# EAGLE design main (EAGLE 6.1)
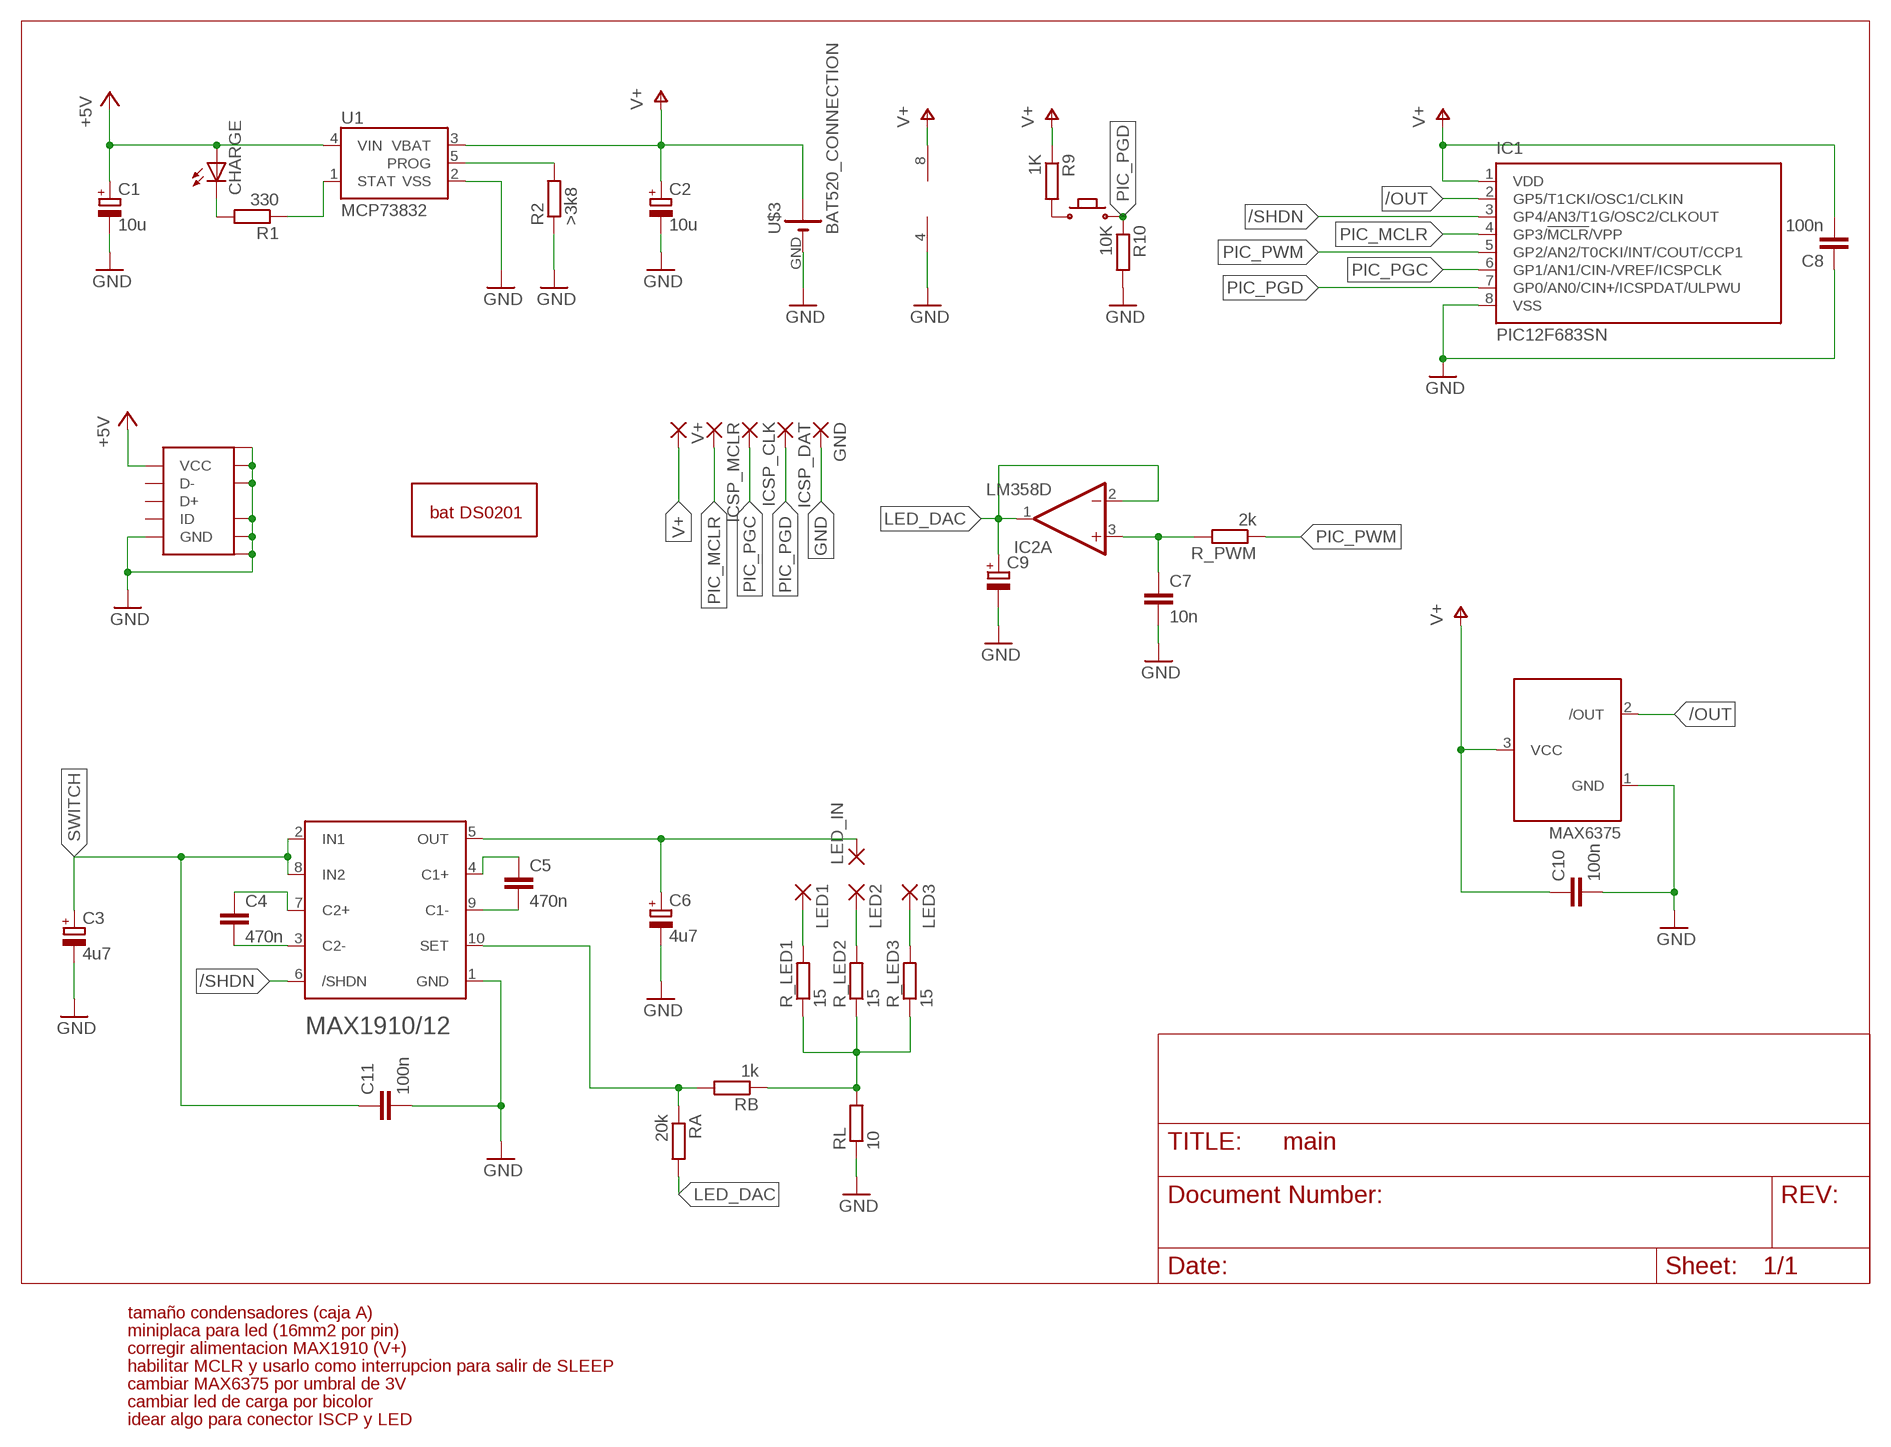
[diagram p0: schematic, sheet 1]

## Parts
C1  10u  CPOL-EUSMCA  [SMC_A]
C2  10u  CPOL-EUSMCA  [SMC_A]
C3  4u7  CPOL-EUSMCA  [SMC_A]
C4  470n  C-EUC1206  [C1206]
C5  470n  C-EUC1206  [C1206]
C6  4u7  CPOL-EUSMCA  [SMC_A]
C7  10n  C-EUC1206  [C1206]
C8  100n  C-EUC1206  [C1206]
C9  CPOL-EUSMCA  [SMC_A]
C10  100n  C-EUC1206  [C1206]
C11  100n  C-EUC1206  [C1206]
CHARGE  LEDCHIPLED_1206  [CHIPLED_1206]
GND  SMD5  [SMD2,54-5,08]
IC1  PIC12F683SN  [SO-08]
IC2  LM358D  [SO08]
ICSP_CLK  SMD5  [SMD2,54-5,08]
ICSP_DAT  SMD5  [SMD2,54-5,08]
ICSP_MCLR  SMD5  [SMD2,54-5,08]
LED1  SMD5  [SMD2,54-5,08]
LED2  SMD5  [SMD2,54-5,08]
LED3  SMD5  [SMD2,54-5,08]
LED_IN  SMD5  [SMD2,54-5,08]
R1  330  R-EU_R1206  [R1206]
R2  >3k8  R-EU_R1206  [R1206]
R9  1K  R-EU_R1206  [R1206]
R10  10K  R-EU_R1206  [R1206]
R_LED1  15  R-EU_R1206  [R1206]
R_LED2  15  R-EU_R1206  [R1206]
R_LED3  15  R-EU_R1206  [R1206]
R_PWM  2k  R-EU_R1206  [R1206]
RA  20k  R-EU_R1206  [R1206]
RB  1k  R-EU_R1206  [R1206]
RL  10  R-EU_R1206  [R1206]
U1  MCP73832  [SOT23-5]
U$1  MAX1910/12  [UMAX/USOP_10L]
U$2  MAX6375  [SC70-3-W]
U$3  BAT520_CONNECTION  [BAT520_CONN_SMD]
U$4  BAT_DS0201_PACKAGE  [BAT_DS0201]
U$5  MICRO_USB_B  [MICRO_USB_B]
U$6  MICROBUTTONE-MERCHAN  [MICROBUTTON_2]
V+  SMD5  [SMD2,54-5,08]

## Nets
+5V: C1.+ CHARGE.A U1.4(VIN) U$5.1(VCC)
/OUT: IC1.2(GP5/T1CKI/OSC1/CLKIN) U$2.2(/OUT)
/SHDN: IC1.3(GP4/AN3/T1G/OSC2/CLKOUT) U$1.6(/SHDN)
GND: C1.- C2.- C3.- C6.- C7.2 C8.1 C9.- C10.2 C11.2 GND.1(P) IC1.8(VSS) IC2.4(P:V-) R2.1 R10.2 RL.1 U1.2(VSS) U$1.1(GND) U$2.1(GND) U$3.GND(-) U$5.5(GND) U$5.GND1(GND) U$5.GND2(GND) U$5.GND3(GND) U$5.GND4(GND) U$5.GND5(GND) U$5.GND6(GND)
LED_DAC: C9.+ IC2.1(A:OUT) IC2.2(A:-IN) RA.2
N$1: R_LED1.1 R_LED2.1 R_LED3.1 RB.1 RL.2
N$2: C7.1 IC2.3(A:+IN) R_PWM.2
N$3: R2.2 U1.5(PROG)
N$4: R1.1 U1.1(STAT)
N$5: C4.2 U$1.3(C2-)
N$6: C4.1 U$1.7(C2+)
N$7: C5.2 U$1.9(C1-)
N$8: C5.1 U$1.4(C1+)
N$10: LED3.1(P) R_LED3.2
N$11: LED2.1(P) R_LED2.2
N$12: RA.1 RB.2 U$1.10(SET)
N$13: LED1.1(P) R_LED1.2
N$14: C6.+ LED_IN.1(P) U$1.5(OUT)
N$15: CHARGE.C R1.2
N$16: R9.2 U$6.P$1
PIC_MCLR: IC1.4(GP3/!MCLR!/VPP) ICSP_MCLR.1(P)
PIC_PGC: IC1.6(GP1/AN1/CIN-/VREF/ICSPCLK) ICSP_CLK.1(P)
PIC_PGD: IC1.7(GP0/AN0/CIN+/ICSPDAT/ULPWU) ICSP_DAT.1(P) R10.1 U$6.P$2
PIC_PWM: IC1.5(GP2/AN2/T0CKI/INT/COUT/CCP1) R_PWM.1
SWITCH: C3.+ C11.1 U$1.2(IN1) U$1.8(IN2)
V+: C2.+ C8.2 C10.1 IC1.1(VDD) IC2.8(P:V+) R9.1 U1.3(VBAT) U$2.3(VCC) U$3.VCC(+) V+.1(P)
Unconnected: IC2.5(B:+IN) IC2.6(B:-IN) IC2.7(B:OUT) U$5.2(D-) U$5.3(D+) U$5.4(ID)

## Notes on the sheet
- tamaño condensadores (caja A)
- miniplaca para led (16mm2 por pin)
- corregir alimentacion MAX1910 (V+)
- habilitar MCLR y usarlo como interrupcion para salir de SLEEP
- cambiar MAX6375 por umbral de 3V
- cambiar led de carga por bicolor
- idear algo para conector ISCP y LED

## Library data of the parts
C1-C3 C6 C9 = rcl:CPOL-EU: POLARIZED CAPACITOR, European symbol
C4 C5 C7 C8 C10 C11 = rcl:C-EU: CAPACITOR, European symbol
CHARGE = led:LED: LED OSRAM: - CHIPLED LG R971, LG N971, LY N971, LG Q971, LY Q971, LO R971, LY R971 LH N974, LH R974 LS Q976, LO Q976, LY Q976 LO Q996 - Hyper CHIPLED LW Q18S LB Q993, LB Q99A, LB R99A - SideLED LS A670, LO A670, LY A670, LG A670, LP A670 LB A673, LV A673, LT A673, LW A673 LH A674 LY A675 LS A676, LA A676, LO A676, LY A676, LW A676 LS A679, LY A679, LG A679 - Hyper Micro SIDELED® LS Y876, LA Y876, LO Y876, LY Y876 LT Y87S - SmartLED LW L88C, LW L88S LB L89C, LB L89S, LG L890 LS L89K, LO L89K, LY L89K LS L896, LA L896, LO L896, LY L896 - TOPLED LS T670, LO T670, LY T670, LG T670, LP T670 LSG T670, LSP T670, LSY T670, LOP T670, LYG T670 LG T671, LOG T671, LSG T671 LB T673, LV T673, LT T673, LW T673 LH T674 LS T676, LA T676, LO T676, LY T676, LB T676, LH T676, LSB T676, LW T676 LB T67C, LV T67C, LT T67C, LS T67K, LO T67K, LY T67K, LW E67C LS E67B, LA E67B, LO E67B, LY E67B, LB E67C, LV E67C, LT E67C LW T67C LS T679, LY T679, LG T679 LS T770, LO T770, LY T770, LG T770, LP T770 LB T773, LV T773, LT T773, LW T773 LH T774 LS E675, LA E675, LY E675, LS T675 LS T776, LA T776, LO T776, LY T776, LB T776 LHGB T686 LT T68C, LB T68C - Hyper Mini TOPLED® LB M676 - Mini TOPLED Santana® LG M470 LS M47K, LO M47K, LY M47K Source: http://www.osram.convergy.de LUXEON: - LUMILED® LXK2-PW12-R00, LXK2-PW12-S00, LXK2-PW14-U00, LXK2-PW14-V00 LXK2-PM12-R00, LXK2-PM12-S00, LXK2-PM14-U00 LXK2-PE12-Q00, LXK2-PE12-R00, LXK2-PE12-S00, LXK2-PE14-T00, LXK2-PE14-U00 LXK2-PB12-K00, LXK2-PB12-L00, LXK2-PB12-M00, LXK2-PB14-N00, LXK2-PB14-P00, LXK2-PB14-Q00 LXK2-PR12-L00, LXK2-PR12-M00, LXK2-PR14-Q00, LXK2-PR14-R00 LXK2-PD12-Q00, LXK2-PD12-R00, LXK2-PD12-S00 LXK2-PH12-R00, LXK2-PH12-S00 LXK2-PL12-P00, LXK2-PL12-Q00, LXK2-PL12-R00 Source: www.luxeon.com KINGBRIGHT: KA-3528ASYC Source: www.kingbright.com
GND ICSP_CLK ICSP_DAT ICSP_MCLR LED1-LED3 LED_IN V+ = wirepad:SMD5: SMD PAD
IC1 = microchip:PIC12F683: 8-Pin Flash-Based, 8-Bit CMOS Microcontrollers with nanoWatt Technology Source: http://ww1.microchip.com/downloads/en/DeviceDoc/41211D_.pdf; MF: MICROCHIP; MPN: PIC12F683-I/SN; OC_FARNELL: 9759042; OC_NEWARK: 61K3434
IC2 = linear:LM358: OP AMP also LM158; LM258; LM2904 Source: http://cache.national.com/ds/LM/LM158.pdf
R1 R2 R9 R10 R_LED1-R_LED3 R_PWM RA RB RL = rcl:R-EU_: RESISTOR, European symbol
U1 = dan:MCP73832: Microchip's MCP73832 Miniature single cell, fully integrated Li-Ion, Li-polymer charge management controller http://ww1.microchip.com/downloads/en/DeviceDoc/21984a.pdf
U$1 = dan:MAX1910/12: MAX1910/12 1.5X/2X High-Efficiency White LED Charge Pumps
U$2 = dan:MAX6375: MAX6375 3 pin, ultra-low-power sc70/sot23 voltage detectors
U$3 = dan:BAT520_CONNECTION
U$4 = dan:BAT_DS0201_PACKAGE
U$5 = dan:MICRO_USB_B: Receptáculo micro USB tipo B (móviles). REF tienda (www.rs-online.es): 669-4645. REF fabricante (TE Connectivity): 1981568-1.
U$6 = dan:MICROBUTTON

## Board
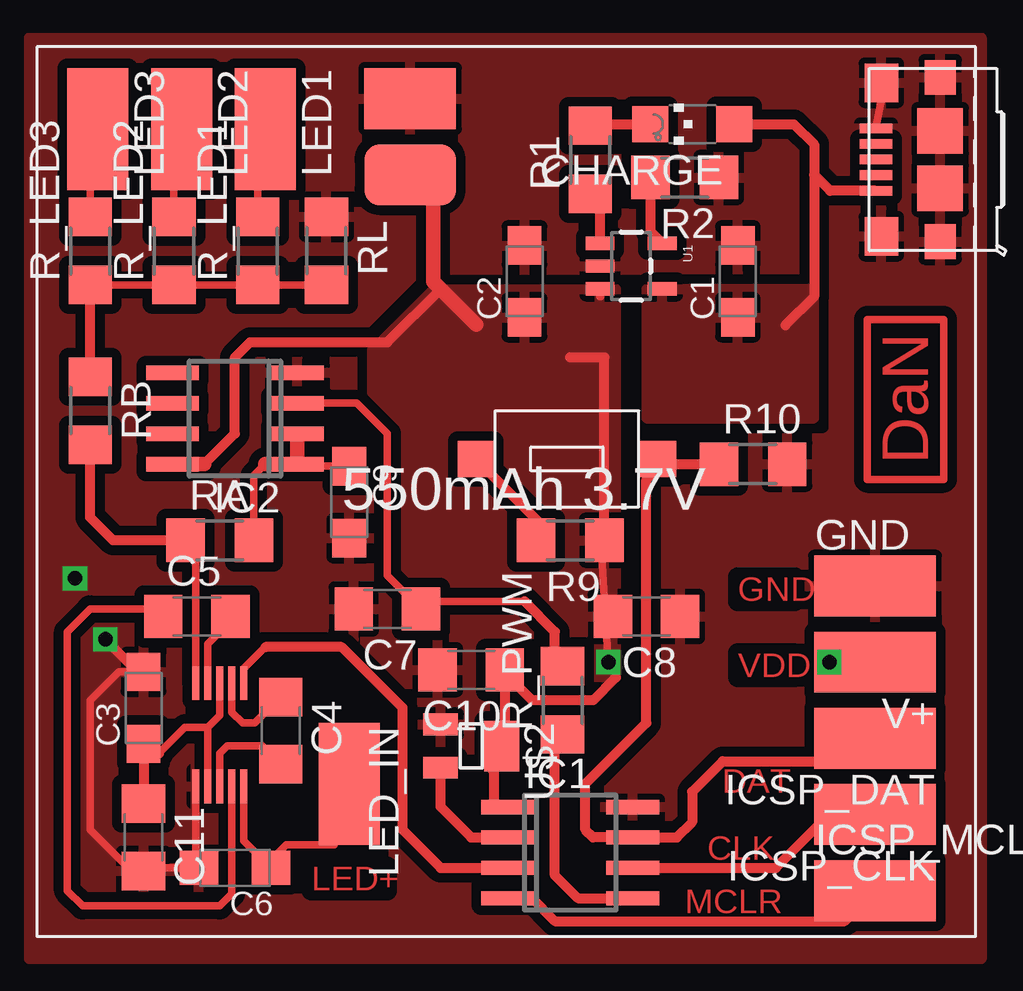
[diagram p1: board, top side]
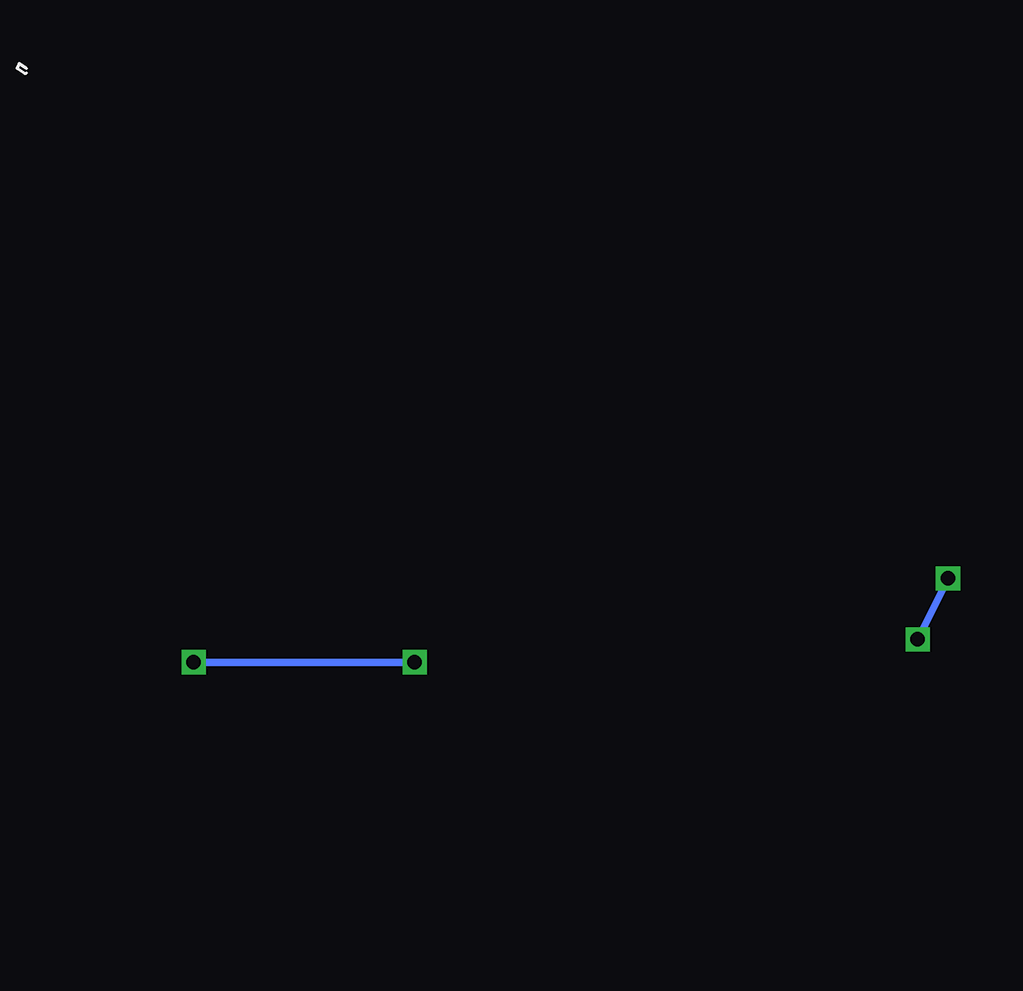
[diagram p2: board, bottom side, seen from below]

No outline drawn. Coordinates in mm, seen from the top.
Copper layers (1*16): Top 0.035mm / dielectric 1.5mm / Bottom 0.035mm
Design rules: minimum track width 10mil, minimum drill 24mil, track to track 16mil, track to pad 16mil, pad to pad 16mil, via to via 16mil, smd to smd 16mil, copper to edge 0mil, drill to drill 8mil, minimum pad ring 10mil, minimum via ring 8mil, stop-mask expansion 4mil, vias tented up to drill 0mil, thermal gap 10mil

### Footprints (pad centres in the part's own frame; a part is rotated, then mirrored left to right if it is on the bottom)
SMC_A = smd 1.6 x 1.4: + -1.5,0; - 1.5,0
C1206 = smd 1.6 x 1.8: 1 -1.4,0; 2 1.4,0
CHIPLED_1206 = smd 1.5 x 1.5: A 0,-1.75; C 0,1.75
SMD2,54-5,08 = smd 2.54 x 5.08: 1 0,0
SO-08 = smd 0.6 x 2.2: 1 -1.905,-2.6; 2 -0.635,-2.6; 3 0.635,-2.6; 4 1.905,-2.6; 5 1.905,2.6; 6 0.635,2.6; 7 -0.635,2.6; 8 -1.905,2.6
SO08 = smd 0.6 x 2.2: 1 -1.905,-2.6; 2 -0.635,-2.6; 3 0.635,-2.6; 4 1.905,-2.6; 5 1.905,2.6; 6 0.635,2.6; 7 -0.635,2.6; 8 -1.905,2.6
R1206 = smd 1.6 x 1.803: 1 -1.422,0; 2 1.422,0
SOT23-5 = smd 0.55 x 1.2: 1 -0.95,-1.3; 2 0,-1.3; 3 0.95,-1.3; 4 0.95,1.3; 5 -0.95,1.3
UMAX/USOP_10L = smd 1.4 x 0.28: 1 -2,1; 2 -2,0.5; 3 -2,0; 4 -2,-0.5; 5 -2,-1; 6 2.3,-1; 7 2.3,-0.5; 8 2.3,0; 9 2.3,0.5; 10 2.3,1
SC70-3-W = smd 0.9 x 1.45: 1 -0.9,-1.275; 2 0.9,-1.275 | smd 2.1 x 1.45: 3 0,1.275
BAT520_CONN_SMD = smd 2.54 x 3.81: GND 1.905,0; VCC -1.27,0
MICRO_USB_B = smd 0.4 x 1.35: 1 -1.3,1.865; 2 -0.65,1.865; 3 0,1.865; 4 0.65,1.865; 5 1.3,1.865 | smd 1.6 x 1.4: GND1 -3.2,1.64; GND2 3.2,1.64 | smd 1.45 x 1.3: GND3 -3.425,-0.81; GND4 3.425,-0.81 | smd 1.9 x 1.9: GND5 -1.2,-0.81; GND6 1.2,-0.81
MICROBUTTON_2 = smd 1.5 x 1.5: P$1 3.625,0.095; P$2 -3.975,0.095

### Placement (x,y rotation side)
C1  29.21,27.3 90 top
C2  20.32,27.3 90 top
C3  4.45,9.53 90 top
C4  10.16,8.57 270 top
C5  6.67,13.34 0 top
C6  8.26,2.86 180 top
C7  14.61,13.65 180 top
C8  25.4,13.34 180 top
C9  13.02,18.1 270 top
C10  18.1,11.11 180 top
C11  4.45,4.13 270 top
CHARGE  27.32,33.86 90 top
GND  34.92,14.61 270 top
IC1  22.23,3.49 270 top
IC2  8.26,21.59 90 top
ICSP_CLK  34.92,5.08 90 top
ICSP_DAT  34.92,8.26 90 top
ICSP_MCLR  34.92,1.91 270 top
LED1  9.53,33.66 180 top
LED2  6.03,33.66 180 top
LED3  2.54,33.66 180 top
LED_IN  13.02,6.35 180 top
R1  23.06,32.38 90 top
R2  27,31.64 180 top
R9  22.23,16.51 180 top
R10  29.84,19.68 0 top
R_LED1  9.21,28.57 90 top
R_LED2  5.71,28.57 90 top
R_LED3  2.22,28.57 90 top
R_PWM  21.91,9.84 90 top
RA  7.62,16.51 0 top
RB  2.22,21.91 270 top
RL  12.06,28.57 270 top
U1  24.77,27.94 270 top
U$1  7.62,8.26 90 top
U$2  18.1,7.94 270 top
U$3  15.56,33.02 90 top
U$4  19.05,19.05 0 top
U$5  36.83,32.38 90 top
U$6  21.91,20 180 top
V+  34.92,11.43 90 top

### Tracks (layer width: path | path; a pad name or v marks a point on that pad's centre or on a via)
+5V
  Top 0.406: CHARGE.A 31.55,33.86 32.38,33.02 32.38,31.75 | 32.38,31.75 32.38,26.67 31.19,25.48 | U$5.1 33.05,31.09 32.38,31.75
  pour Top (isolate 0.305): 25.4,26.99 25.4,21.59 32.38,21.59 32.38,26.99
/OUT
  Top 0.406: U$2.2 16.82,5.4 18.1,4.13 IC1.2
/SHDN
  Top 0.305: U$1.6 8.62,11.16 9.53,12.06
  Top 0.406: IC1.3 16.83,2.86 15.24,4.45 15.24,9.53 12.7,12.06 9.53,12.06
GND  (via drill 0.6)
  Top 0.305: U$5.5 35.28,35.36 U$5.GND2 | v1.59,14.92 1.27,15.24 | U$1.1 6.62,2.99 C6.- 4.58,2.86 C11.2 3.94,2.73 2.22,4.45 2.22,9.84 3.4,11.03 C3.-
  Top 0.406: v2.86,12.38 4.21,11.03 C3.-
  Bottom 0.305: v2.86,12.38 v1.59,14.92
  pour Top (rank 6): 39.37,-0.95 -0.32,-0.95 -0.32,37.47 39.37,37.47
LED_DAC
  Top 0.305: RA.2 9.04,19.2 9.53,19.68 | C9.+ 10.88,19.6 10.79,19.68
  Top 0.61: IC2.2 IC2.1 10.79,19.68 9.53,19.68
N$1
  Top 0.305: 2.54,26.67 R_LED3.1 R_LED2.1 R_LED1.1 RL.2
  Top 0.406: RB.1 R_LED3.1
N$2
  Top 0.305: 20.32,13.97 15.88,13.97 15.88,13.34 16,13.46 C7.1 14.61,15.05 14.61,20.95 13.34,22.23 IC2.3
  Top 0.406: R_PWM.2 21.59,11.58 21.59,12.7 20.32,13.97
N$3
  Top 0.406: U1.5 25.58,29.38 R2.2
N$4
  Top 0.406: R1.1 23.46,30.55 U1.1
N$5
  Top 0.305: U$1.3 7.62,7.62 7.94,7.94 9.39,7.94 C4.2
N$6
  Top 0.305: U$1.7 8.12,9.34 8.57,8.89 9.08,8.89 C4.1
N$7
  Top 0.305: U$1.9 7.12,12.2 8.26,13.34 C5.2
N$8
  Top 0.305: U$1.4 8.12,1.77 7.62,1.27 1.91,1.27 1.27,1.91 1.27,12.7 2.22,13.65 4.76,13.65 arc-90 5.08,13.34 C5.1
N$9
  Top 0.305: 37.78,19.05 37.78,25.72 34.61,25.72 34.61,19.05 37.78,19.05
N$10
  Top 0.305: R_LED3.2 2.22,33.34 LED3.1
N$11
  Top 0.305: R_LED2.2 5.71,33.34 LED2.1
N$12
  Top 0.305: U$1.10 6.62,16.51 RA.1
  Top 0.406: 6.35,16.51 RA.1 3.17,16.51 2.22,17.46 RB.2 2.22,20.64
N$13
  Top 0.305: R_LED1.2 9.21,33.34 LED1.1
N$14
  Top 0.254: LED_IN.1 13.34,6.35
  Top 0.305: U$1.5 8.62,3.99 C6.+ 9.53,2.63 | 13.34,6.35 12.38,5.4 12.38,3.81 10.39,3.81 9.53,2.94 | 9.53,2.94 9.53,2.63 | 9.53,2.94 9.53,3.17 | 9.53,2.63 9.53,2.54
N$15
  Top 0.406: R1.2 23.12,33.86 CHARGE.C
N$16
  Top 0.305: R9.2 20.95,16.51
  Top 0.406: U$6.P$1 20.95,17.23 20.95,16.51
PIC_MCLR
  Top 0.305: 19.68,1.59 IC1.4
  Top 0.406: 19.68,1.59 20.64,1.59 21.59,0.64 33.66,0.64 ICSP_MCLR.1
PIC_PGC
  Top 0.406: IC1.6 30.8,2.86 33.02,5.08 ICSP_CLK.1 36.83,4.45
PIC_PGD
  Top 0.305: 26.04,19.68 R10.1
  Top 0.406: 26.04,20.32 26.04,19.68 25.4,19.05 25.4,8.89 22.86,6.35 22.86,4.45 23.18,4.13 IC1.7 26.67,4.13 27.3,4.76 27.3,6.03 28.57,7.3 33.97,7.3 arc90 ICSP_DAT.1 | U$6.P$2 26.11,19.68 R10.1 28.57,19.68 | ICSP_DAT.1 36.83,8.26 | ICSP_DAT.1 35.24,7.3
PIC_PWM
  Top 0.305: R_PWM.1 22.06,8.42 22.23,8.26
  Top 0.406: 22.23,8.26 22.23,8.89 21.59,8.26 21.59,2.54 22.54,1.59 IC1.5
SWITCH
  Top 0.305: U$1.8 7.62,9.21 7.12,8.71 | 7.12,8.71 U$1.2 | 7.12,8.71 6.17,8.71 5.08,7.62
  Top 0.406: 5.08,7.62 4.45,7.62 | C3.+ 4.45,7.62 | 4.45,7.62 C11.1
V+  (via drill 0.6)
  Top 0.305: 23.5,26.67 23.46,26.67 U1.3 | U$3.VCC 15.88,31.75 16.19,32.07 | v23.81,11.43 23.5,16.51 | 19.68,10.79 19.68,10.93 C10.1 | v33.02,11.43 34.29,12.06 V+.1
  Top 0.406: 6.99,19.68 8.26,20.95 8.26,24.13 8.89,24.77 14.61,24.77 16.83,26.99 | C10.1 19.5,7.81 19.68,7.62 | 19.37,7.62 19.68,7.62 | 19.68,7.62 U$2.3 19.37,7.62 | 18.99,6.92 19.68,7.62 | 24.13,10.79 23.18,9.84 20.64,9.84 19.68,10.79 | 24.13,16.51 R9.1 23.65,24.13 22.23,24.13 | IC1.1 19.05,5.4 19.05,7.62 19.37,7.62
  Top 0.61: 18.32,25.5 16.83,26.99 16.51,27.3 16.51,31.75 16.19,32.07 15.88,32.38 | IC2.8 6.99,19.68
  Bottom 0.305: v33.02,11.43 v23.81,11.43
  pour Top (isolate 0.305): 24.13,26.99 24.13,10.79 21.59,10.79 21.59,13.97 13.97,14.61 13.97,24.45 16.51,26.99

### Text on the board
Top: DaN | GND | VDD | DAT | CLK | LED+ | MCLR